# EAGLE design brightness_control (EAGLE 6.6.0)
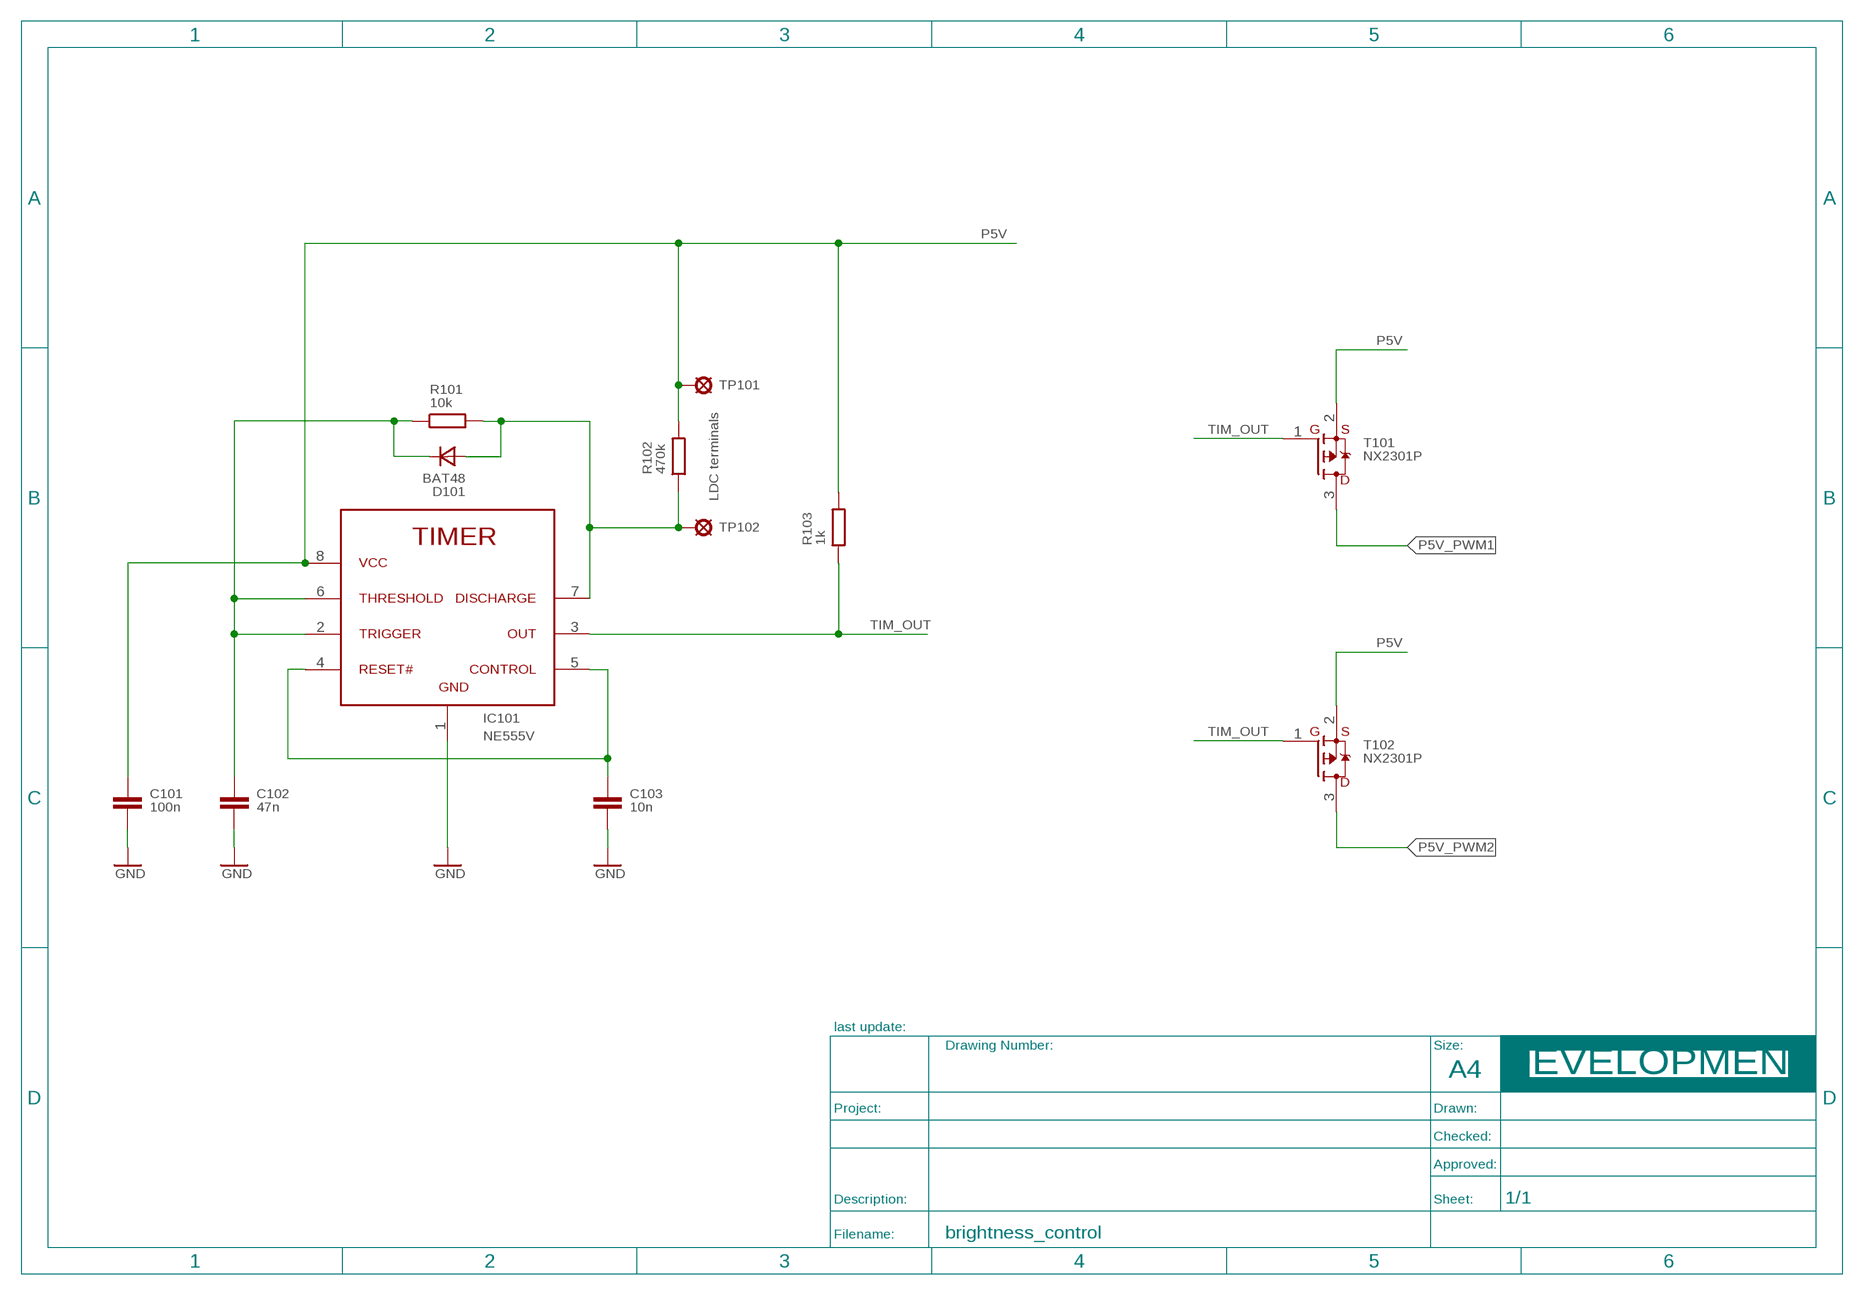
[diagram p0: schematic, sheet 1]
FRAME_DEVELOPMENT1 (A4_LANDSCAPE_DEVELOPMENT): BOM: NO; COMMISSIONED: 2013-08-30

## Parts
C101  100n  C_EU_S_0805  [S_0805]
C102  47n  C_EU_S_0805  [S_0805]
C103  10n  C_EU_S_0805  [S_0805]
D101  BAT48  SINGLE_T_DO204/10  [T_DO204_GRID_10MM]
IC101  NE555V  555P  [T_NDIP8]
R101  10k  R_EU_S_0805  [S_0805]
R102  470k  R_EU_S_0805  [S_0805]
R103  1k  R_EU_S_0805  [S_0805]
T101  NX2301P  P-MOSFET  [S_SOT23]
T102  NX2301P  P-MOSFET  [S_SOT23]
TP101  TEST_POINT_T_LARGE  [T_TEST_POINT_LARGE]
TP102  TEST_POINT_T_LARGE  [T_TEST_POINT_LARGE]

## Nets
GND [pwr]: C101.2 C102.2 C103.2 IC101.1(GND)
P5V [pwr]: C101.1 IC101.8(VCC) R102.2 R103.2 T101.2(S) T102.2(S) TP101.1(MP)
P5V_PWM1: T101.3(D)
P5V_PWM2: T102.3(D)
TIM_1: C103.1 IC101.4(RST#) IC101.5(OC)
TIM_2: C102.1 D101.C IC101.2(TRG) IC101.6(TRSHLD) R101.1
TIM_3: D101.A IC101.7(DSCHRG) R101.2 R102.1 TP102.1(MP)
TIM_OUT: IC101.3(OUT) R103.1 T101.1(G) T102.1(G)

## Notes on the sheet
- LDC terminals

## Library data of the parts
C101 = be_rcl:C_EU: drawn: Mario Blunk / Blunk electronic; BOM: YES; COMMISSIONED: 2013-08-30; PART_CODE_BEL: C_PAC_S_0805_VAL_100n
C102 = be_rcl:C_EU: drawn: Mario Blunk / Blunk electronic; BOM: YES; COMMISSIONED: 2013-08-30; PART_CODE_BEL: C_PAC_S_0805_VAL_47n
C103 = be_rcl:C_EU: drawn: Mario Blunk / Blunk electronic; BOM: YES; COMMISSIONED: 2013-08-30; PART_CODE_BEL: C_PAC_S_0805_VAL_10n
D101 = be_diode:SINGLE: edited: Mario Blunk / Blunk electronic; BOM: YES; COMMISSIONED: 2014-09-03; PART_CODE_BEL: D_PAC_T_DO204_GRID_10mm_VAL_; UPDATED: 2015-04-14
IC101 = be_timer:555: edited: Mario Blunk / Blunk electronic; BOM: YES; COMMISSIONED: 2015-10-15; PART_CODE_BEL: IC_PAC_T_NDIP8_VAL_NE555V
R101 = be_rcl:R_EU: Resistor Device EU drawn: Mario Blunk / Blunk electronic; BOM: YES; COMMISSIONED: 2013-08-30; PART_CODE_BEL: R_PAC_S_0805_VAL_10k
R102 = be_rcl:R_EU: Resistor Device EU drawn: Mario Blunk / Blunk electronic; BOM: YES; COMMISSIONED: 2013-08-30; PART_CODE_BEL: R_PAC_S_0805_VAL_470k
R103 = be_rcl:R_EU: Resistor Device EU drawn: Mario Blunk / Blunk electronic; BOM: YES; COMMISSIONED: 2013-08-30; PART_CODE_BEL: R_PAC_S_0805_VAL_1k
T101 T102 = be_transistor:P-MOSFET: P-MOSFET transistor device drawn: Mario Blunk / Blunk electronic; BOM: YES; COMMISSIONED: 2013-08-30; PART_CODE_BEL: T_PAC_S_SOT23_VAL_NX2301P
TP101 TP102 = be_con_jump:TEST_POINT: test point device drawn: Mario Blunk / Blunk electronic; BOM: NO; COMMISSIONED: 2014-09-03; PART_CODE_BEL: TP_PAC_T_TEST_POINT_SMALL

## Net classes
1 pwr: width 0.3 mm

## Board
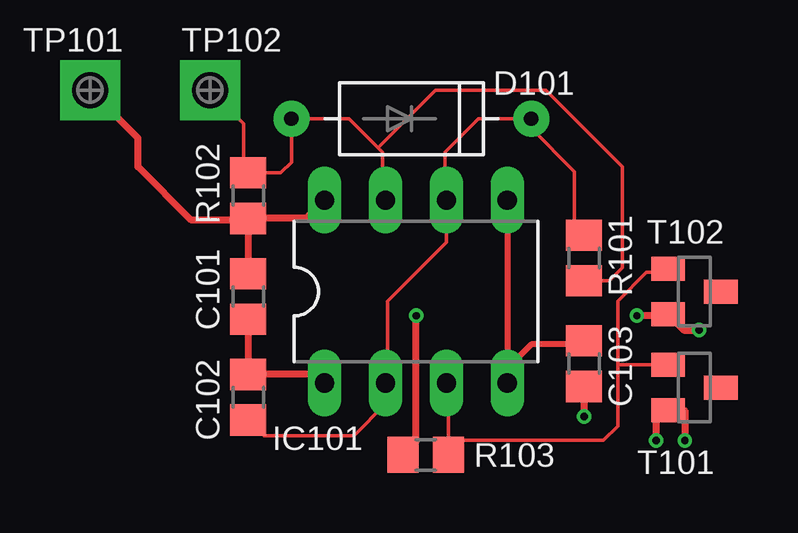
[diagram p1: board, top side]
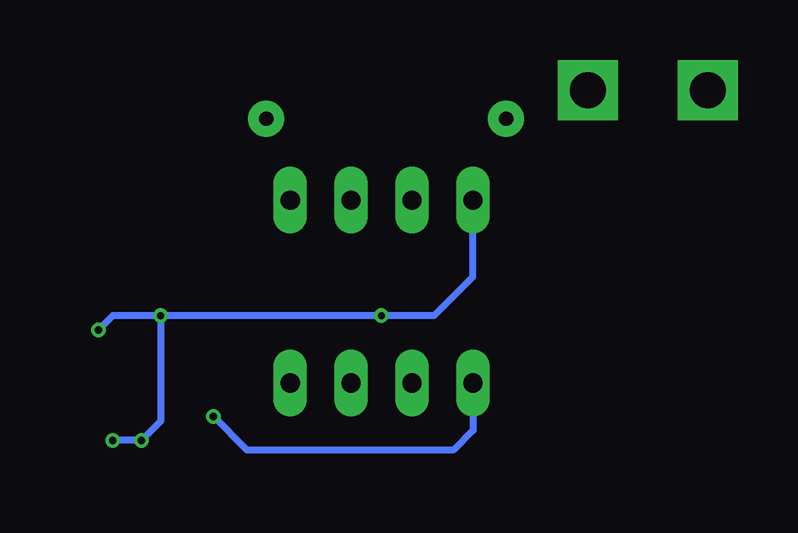
[diagram p2: board, bottom side, seen from below]

No outline drawn. Coordinates in mm, seen from the top.
Copper layers (1*16): Top 0.035mm / dielectric 1.6mm / Bottom 0.035mm
Design rules "JLP_BL_std": minimum track width 0.15mm, minimum drill 0.3mm, track to track 0.15mm, track to pad 0.15mm, pad to pad 0.15mm, via to via 0.15mm, smd to smd 0.15mm, copper to edge 0.5mm, drill to drill 0.2mm, minimum pad ring 0.3mm, minimum via ring 0.15mm, stop-mask expansion 0.075mm, vias tented up to drill 0.3mm, thermal gap 0.2mm

### Footprints (pad centres in the part's own frame; a part is rotated, then mirrored left to right if it is on the bottom)
S_0805 = smd 1.3 x 1.5: 1 -0.95,0; 2 0.95,0
T_DO204_GRID_10MM = drill 0.6 pad 1.5: A -5,0; C 5,0
T_NDIP8 = drill 0.8 long: 1 -3.82,-3.81; 2 -1.28,-3.81; 3 1.26,-3.81; 4 3.8,-3.81; 5 3.8,3.81; 6 1.26,3.81; 7 -1.28,3.81; 8 -3.82,3.81
S_SOT23 = smd 1 x 1.4: 1 -0.95,-1.1; 2 0.95,-1.1; 3 0,1.1
T_TEST_POINT_LARGE = drill 1.5 pad 2.5 square: 1 0,0

### Placement (x,y rotation side)
C101  6.6,10.4 270 top
C102  6.6,6.2 90 top
C103  20.6,7.6 270 top
D101  13.4,17.8 0 top
IC101  13.6,10.6 0 top
R101  20.6,12 270 top
R102  6.6,14.6 270 top
R103  14,3.8 180 top
T101  25.2,6.6 270 top
T102  25.2,10.6 270 top
TP101  0,19 0 top
TP102  5,19 0 top

### Tracks (layer width: path | path; a pad name or v marks a point on that pad's centre or on a via)
GND  (via drill 0.3)
  Top 0.3: C103.2 v20.6,5.4 | C101.2 C102.2 9.42,7.15 IC101.1
  Bottom 0.3: IC101.1 9.78,4.82 10.6,4 19.2,4 v20.6,5.4
P5V  (via drill 0.3)
  Top 0.3: 9.8,14.39 IC101.8 9.02,13.65 R102.2 | v23.6,4.4 23.6,5.65 T101.2 24.8,5.65 v24.8,4.4 | v25.4,9 24.75,9 T102.2 24.05,9.6 v22.8,9.6 | R102.2 6.55,13.6 4.2,13.6 2,15.8 2,17 TP101.1 | R102.2 C101.1 | R103.2 13.6,4.35 v13.6,9.6
  Bottom 0.3: v22.8,9.6 v13.6,9.6 11.4,9.6 9.8,11.2 9.8,14.39 IC101.8 | v22.8,9.6 22.8,5.2 v23.6,4.4 v24.8,4.4 | v22.8,9.6 24.8,9.6 v25.4,9
TIM_1
  Top 0.254: C103.1 20.45,8.4 18.4,8.4 17.4,7.4 IC101.4 IC101.5
TIM_2
  Top 0.15: R101.1 20.2,13.35 20.2,15.6 18.4,17.4 D101.C 16.2,17.8 14.8,16.4 14.8,14.47 IC101.6 14.86,12.66 12.4,10.2 12.4,6.87 IC101.2 12.32,5.92 11,4.6 7.25,4.6 C102.1
TIM_3
  Top 0.15: IC101.7 12.2,14.53 12.2,16.4 12,16.6 | 12,16.6 10.8,17.8 D101.A 8.4,16 7.95,15.55 R102.1 6.4,15.75 6.4,17.6 TP102.1 | R101.2 21.65,11.05 22.2,11.6 22.2,15.8 19,19 14.4,19 12,16.6
TIM_OUT
  Top 0.15: IC101.3 14.95,6.7 R103.1 15.55,4.4 21.4,4.4 22,5 22,7.55 | 22,7.55 T101.1 | T102.1 23.95,11.4 23.2,11.4 22,10.2 22,7.55